# Altium schematic sheet Op_Amp_Sig_Process.SchDoc: Op-Amp Signal Pre-Processing
size B; SheetNumber: 4; SheetTotal: 5
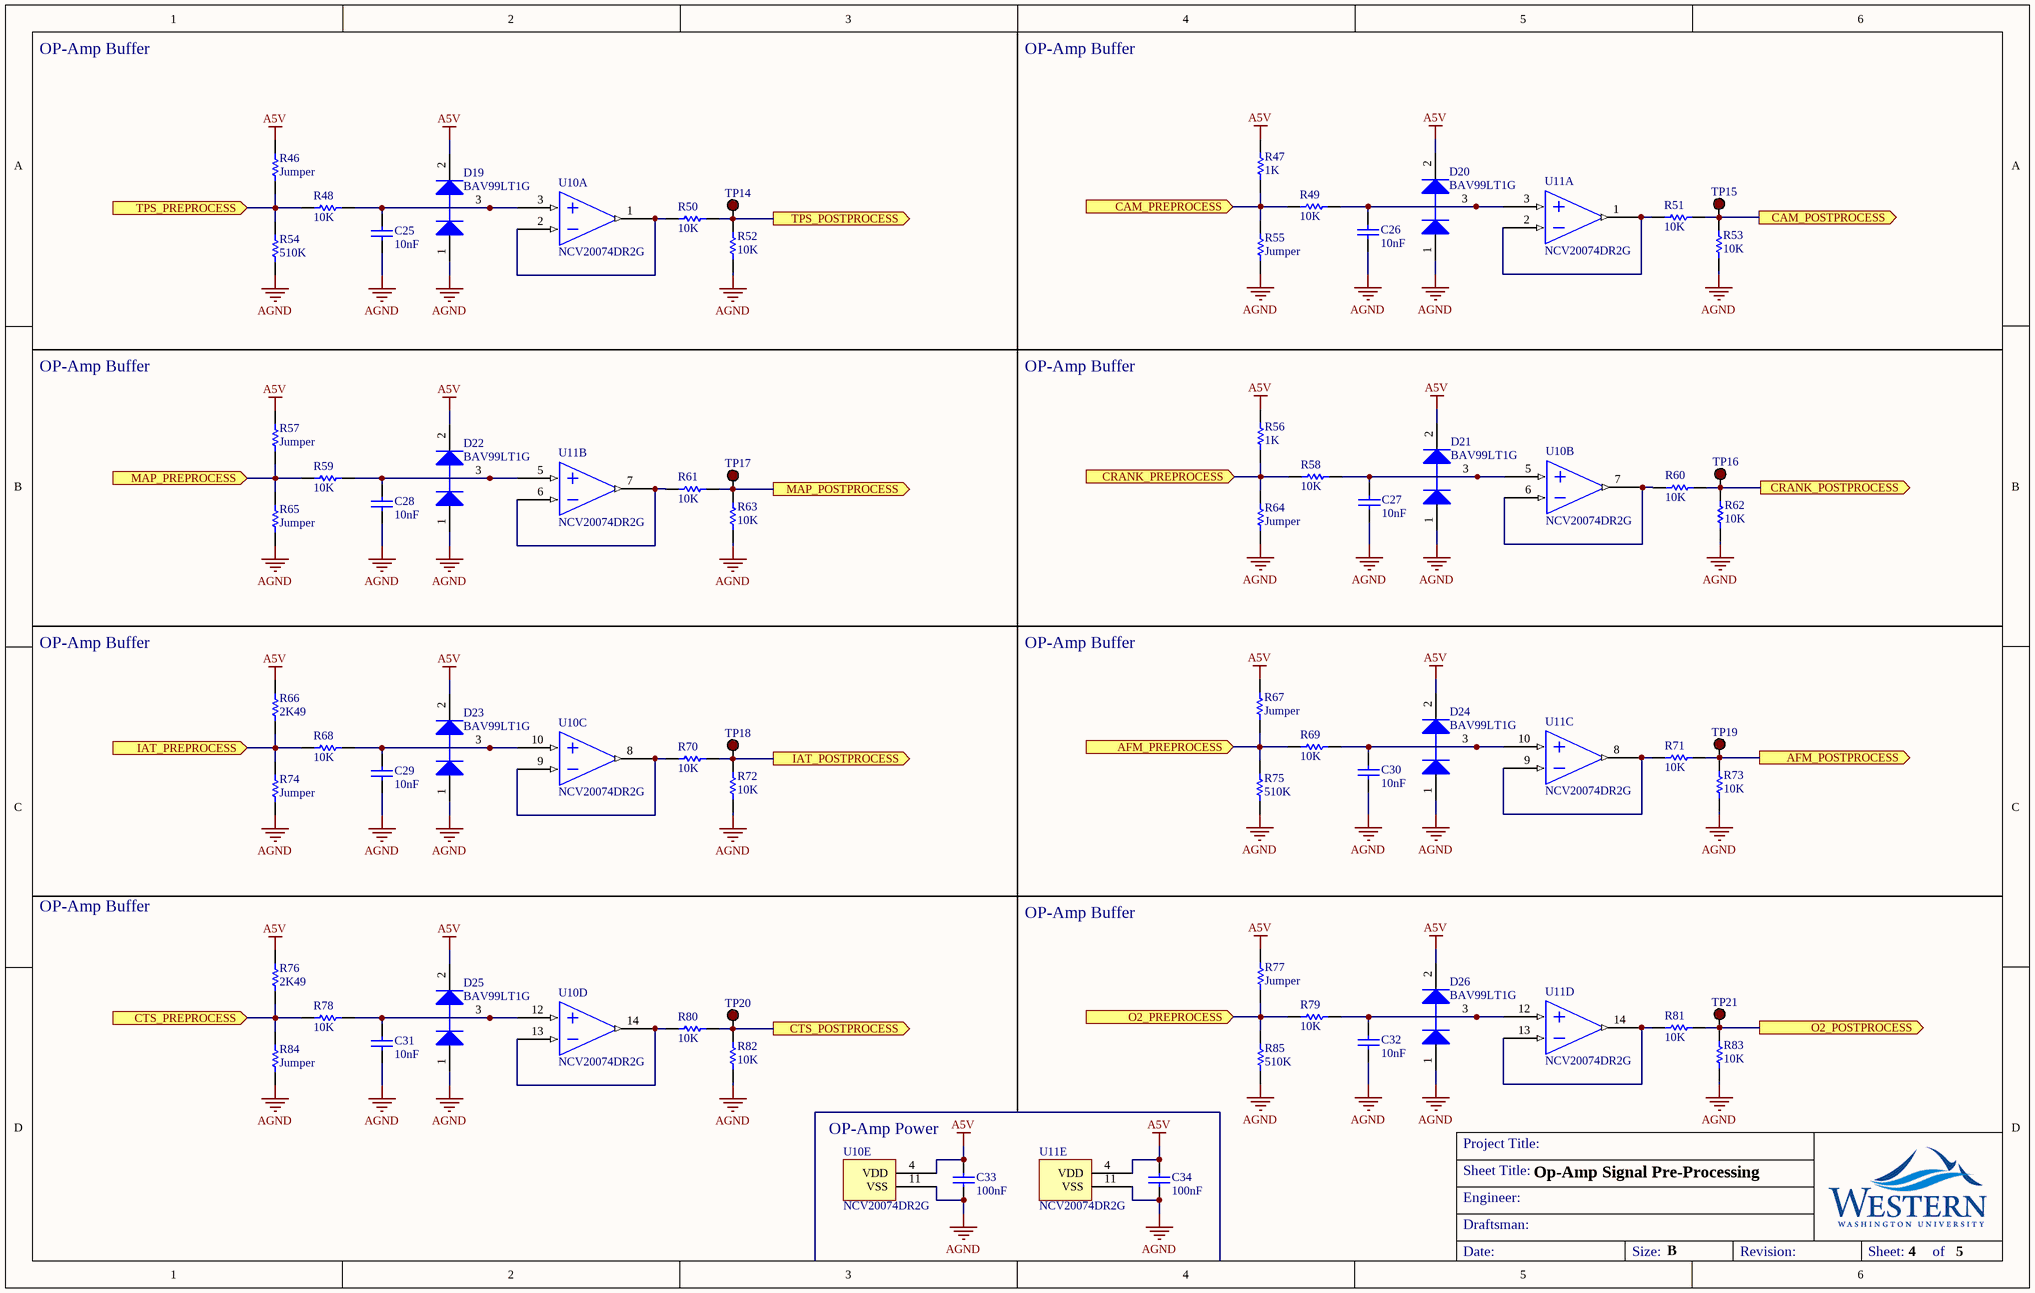
[diagram p0: Op_Amp_Sig_Process.SchDoc]

## Parts
C25  10nF  [CAPC0603(1608)100_M]
C26  10nF  [CAPC0603(1608)100_M]
C27  10nF  [CAPC0603(1608)100_M]
C28  10nF  [CAPC0603(1608)100_M]
C29  10nF  [CAPC0603(1608)100_M]
C30  10nF  [CAPC0603(1608)100_M]
C31  10nF  [CAPC0603(1608)100_M]
C32  10nF  [CAPC0603(1608)100_M]
C33  100nF  [CAPC0603(1608)100_M]
C34  100nF  [CAPC0603(1608)100_M]
D19  BAV99LT1G  [ONSC-SOT-23-3-318-08_V]
D20  BAV99LT1G  [ONSC-SOT-23-3-318-08_V]
D21  BAV99LT1G  [ONSC-SOT-23-3-318-08_V]
D22  BAV99LT1G  [ONSC-SOT-23-3-318-08_V]
D23  BAV99LT1G  [ONSC-SOT-23-3-318-08_V]
D24  BAV99LT1G  [ONSC-SOT-23-3-318-08_V]
D25  BAV99LT1G  [ONSC-SOT-23-3-318-08_V]
D26  BAV99LT1G  [ONSC-SOT-23-3-318-08_V]
R46  Jumper  [RESC0603(1608)_M]
R47  1K  [RESC0603(1608)_M]
R48  10K  [RESC0603(1608)_M]
R49  10K  [RESC0603(1608)_M]
R50  10K  [RESC0603(1608)_M]
R51  10K  [RESC0603(1608)_M]
R52  10K  [RESC0603(1608)_M]
R53  10K  [RESC0603(1608)_M]
R54  510K  [RESC0603(1608)_M]
R55  Jumper  [RESC0603(1608)_M]
R56  1K  [RESC0603(1608)_M]
R57  Jumper  [RESC0603(1608)_M]
R58  10K  [RESC0603(1608)_M]
R59  10K  [RESC0603(1608)_M]
R60  10K  [RESC0603(1608)_M]
R61  10K  [RESC0603(1608)_M]
R62  10K  [RESC0603(1608)_M]
R63  10K  [RESC0603(1608)_M]
R64  Jumper  [RESC0603(1608)_M]
R65  Jumper  [RESC0603(1608)_M]
R66  2K49  [RESC0603(1608)_M]
R67  Jumper  [RESC0603(1608)_M]
R68  10K  [RESC0603(1608)_M]
R69  10K  [RESC0603(1608)_M]
R70  10K  [RESC0603(1608)_M]
R71  10K  [RESC0603(1608)_M]
R72  10K  [RESC0603(1608)_M]
R73  10K  [RESC0603(1608)_M]
R74  Jumper  [RESC0603(1608)_M]
R75  510K  [RESC0603(1608)_M]
R76  2K49  [RESC0603(1608)_M]
R77  Jumper  [RESC0603(1608)_M]
R78  10K  [RESC0603(1608)_M]
R79  10K  [RESC0603(1608)_M]
R80  10K  [RESC0603(1608)_M]
R81  10K  [RESC0603(1608)_M]
R82  10K  [RESC0603(1608)_M]
R83  10K  [RESC0603(1608)_M]
R84  Jumper  [RESC0603(1608)_M]
R85  510K  [RESC0603(1608)_M]
TP14  5001  [Keystone_5001]  (value not drawn)
TP15  5001  [Keystone_5001]  (value not drawn)
TP16  5001  [Keystone_5001]  (value not drawn)
TP17  5001  [Keystone_5001]  (value not drawn)
TP18  5001  [Keystone_5001]  (value not drawn)
TP19  5001  [Keystone_5001]  (value not drawn)
TP20  5001  [Keystone_5001]  (value not drawn)
TP21  5001  [Keystone_5001]  (value not drawn)
U10  NCV20074DR2G  [NCV20074DR2G]  (parts A,B,C,D,E of 5)
U11  NCV20074DR2G  [NCV20074DR2G]  (parts A,B,C,D,E of 5)

## Ports
AFM_POSTPROCESS (out), AFM_PREPROCESS (in), CAM_POSTPROCESS (out), CAM_PREPROCESS (in), CRANK_POSTPROCESS (out), CRANK_PREPROCESS (in), CTS_POSTPROCESS (out), CTS_PREPROCESS (in), IAT_POSTPROCESS (out), IAT_PREPROCESS (in), MAP_POSTPROCESS (out), MAP_PREPROCESS (in), O2_POSTPROCESS (out), O2_PREPROCESS (in), TPS_POSTPROCESS (out), TPS_PREPROCESS (in)

## Nets
A5V: C33.2 C34.2 D19.2(K) D20.2(K) D21.2(K) D22.2(K) D23.2(K) D24.2(K) D25.2(K) D26.2(K) R46.2 R47.2 R56.2 R57.2 R66.2 R67.2 R76.2 R77.2 U10.4(VDD) U11.4(VDD)
AGND: C25.1 C26.1 C27.1 C28.1 C29.1 C30.1 C31.1 C32.1 C33.1 C34.1 D19.1(A) D20.1(A) D21.1(A) D22.1(A) D23.1(A) D24.1(A) D25.1(A) D26.1(A) R52.1 R53.1 R54.1 R55.1 R62.1 R63.1 R64.1 R65.1 R72.1 R73.1 R74.1 R75.1 R82.1 R83.1 R84.1 R85.1 U10.11(VSS) U11.11(VSS)
AFM_POSTPROCESS: R71.2 R73.2 TP19.1(TP) ; port AFM_POSTPROCESS
AFM_PREPROCESS: R67.1 R69.1 R75.2 ; port AFM_PREPROCESS
CAM_POSTPROCESS: R51.2 R53.2 TP15.1(TP) ; port CAM_POSTPROCESS
CAM_PREPROCESS: R47.1 R49.1 R55.2 ; port CAM_PREPROCESS
CRANK_POSTPROCESS: R60.2 R62.2 TP16.1(TP) ; port CRANK_POSTPROCESS
CRANK_PREPROCESS: R56.1 R58.1 R64.2 ; port CRANK_PREPROCESS
CTS_POSTPROCESS: R80.2 R82.2 TP20.1(TP) ; port CTS_POSTPROCESS
CTS_PREPROCESS: R76.1 R78.1 R84.2 ; port CTS_PREPROCESS
IAT_POSTPROCESS: R70.2 R72.2 TP18.1(TP) ; port IAT_POSTPROCESS
IAT_PREPROCESS: R66.1 R68.1 R74.2 ; port IAT_PREPROCESS
MAP_POSTPROCESS: R61.2 R63.2 TP17.1(TP) ; port MAP_POSTPROCESS
MAP_PREPROCESS: R57.1 R59.1 R65.2 ; port MAP_PREPROCESS
O2_POSTPROCESS: R81.2 R83.2 TP21.1(TP) ; port O2_POSTPROCESS
O2_PREPROCESS: R77.1 R79.1 R85.2 ; port O2_PREPROCESS
TPS_POSTPROCESS: R50.2 R52.2 TP14.1(TP) ; port TPS_POSTPROCESS
TPS_PREPROCESS: R46.1 R48.1 R54.2 ; port TPS_PREPROCESS
NetC25_2: C25.2 D19.3(K/A) R48.2 U10.3(IN1+)
NetC26_2: C26.2 D20.3(K/A) R49.2 U11.3(IN1+)
NetC27_2: C27.2 D21.3(K/A) R58.2 U10.5(IN2+)
NetC28_2: C28.2 D22.3(K/A) R59.2 U11.5(IN2+)
NetC29_2: C29.2 D23.3(K/A) R68.2 U10.10(IN3+)
NetC30_2: C30.2 D24.3(K/A) R69.2 U11.10(IN3+)
NetC31_2: C31.2 D25.3(K/A) R78.2 U10.12(IN4+)
NetC32_2: C32.2 D26.3(K/A) R79.2 U11.12(IN4+)
NetR50_1: R50.1 U10.1(OUT1) U10.2(IN1-)
NetR51_1: R51.1 U11.1(OUT1) U11.2(IN1-)
NetR60_1: R60.1 U10.6(IN2-) U10.7(OUT2)
NetR61_1: R61.1 U11.6(IN2-) U11.7(OUT2)
NetR70_1: R70.1 U10.8(OUT3) U10.9(IN3-)
NetR71_1: R71.1 U11.8(OUT3) U11.9(IN3-)
NetR80_1: R80.1 U10.13(IN4-) U10.14(OUT4)
NetR81_1: R81.1 U11.13(IN4-) U11.14(OUT4)

## Notes on the sheet
- OP-Amp Buffer
- OP-Amp Power
- Sheet Title:
- Project Title:
- Engineer:
- Draftsman:
- Date:
- Size:
- B
- Revision:
- Sheet:        of

## Library data of the parts
C25-C32 = CMP-1035-02320-1: CAP 10nF 50V ±5% 0603 (1608 Metric) Thickness 1mm SMD; Case-EIA: 0603; Tolerance: Â±5%; Case-Metric: 1608; Value: 10nF; Max Thickness: 1 mm; Technology: SMT; Rated Voltage: 50 V
C33 C34 = CMP-1035-02580-1: CAP 100nF 10V ±10% 0603 (1608 Metric) Thickness 1mm SMD; Tolerance: Â±10%; Case-EIA: 0603; Case-Metric: 1608; Max Thickness: 1 mm; Value: 100nF; Rated Voltage: 10 V; Technology: SMT
D19-D26 = CMP-1054-00085-1: Dual Series Switching Diodes, 3-Pin SOT-23, Pb-Free, Tape and Reel; Manufacturer: On Semiconductor; trr Max (ns): 6; IF Max (A): 0.215; Configuration: Dual Series; PackageDescription: 3-Pin Small Outline Transistor, Body 2.92 x 1.3 mm, Pitch 0.95 mm; PackageVersion: Rev. AP, 11/2009; ComponentLink1Description: Manufacturer URL; RoHS: TRUE; PartNumber: BAV99LT1G; ComponentLink3URL: http://www.onsemi.cn/pub_link/Collateral/318-08.PDF; DatasheetVersion: Rev. 9; PackageReference: SOT-23-3-318-08; ComponentLink2Description: Datasheet; Packing: Tape and Reel; Mounting Technology: Surface Mount; ComponentLink1URL: http://www.onsemi.com/; ComponentLink3Description: Package Specification; ComponentLink2URL: http://www.onsemi.cn/pub_link/Collateral/BAV99LT1-D.PDF
R46 R55 R57 R64 R65 R67 R74 R77 R84 = CMP-1012-00001-1: Jumper 0603 (1608 Metric); Case-Metric: 1608; Value: 0.00 Ohm; Power: None; Case-EIA: 0603; Technology: SMT; Tolerance: None
R47 R56 = CMP-1012-00510-1: 1K 0.1W 1% 0603 (1608 Metric)  SMD; Case-Metric: 1608; Case-EIA: 0603; Value: 1000.00 Ohm; Technology: SMT; Tolerance: 1 %; Power: 0.1 W
R48-R53 R58-R63 R68-R73 R78-R83 = CMP-1012-00623-1: 10K 0.1W 1% 0603 (1608 Metric)  SMD; Value: 10000.00 Ohm; Case-EIA: 0603; Case-Metric: 1608; Power: 0.1 W; Tolerance: 1 %; Technology: SMT
R54 R75 R85 = CMP-1012-00816-1: 510K 0.1W 1% 0603 (1608 Metric)  SMD; Value: 510000.00 Ohm; Case-EIA: 0603; Case-Metric: 1608; Tolerance: 1 %; Technology: SMT; Power: 0.1 W
R66 R76 = CMP-1012-00553-1: 2K49 0.1W 1% 0603 (1608 Metric)  SMD; Case-EIA: 0603; Value: 2490.00 Ohm; Case-Metric: 1608; Tolerance: 1 %; Technology: SMT; Power: 0.1 W
TP14-TP21 = TEST POINT: TEST POINT PC MINI .040"D BLACK; Manufacturer: Keystone Electronics; Supplier 1: Digi-Key; Manufacturer Part Number: 5001; RoHS: RoHS Compliant; Category: Test and Measurement; Stock 1: 7538; Pricing 1: 1=0.34, 10=0.315, 50=0.2296, 100=0.2206, 250=0.19812, 500=0.1891, 1000=0.15759, 2500=0.14408, 5000=0.13508 (USD); Packaging: Bulk; Type: PC Test Point, Miniature; Terminal: 0.010" x 0.020" (0.25mm x 0.51mm) Phosphor Bronze Wire, Silver Plated; Mounting Type: 0.040" (1.02mm) Hole Diameter; Material: Base, Nylon 46, UL 94V-0; Color: Black; ComponentLink1URL: http://www.keyelco.com/product-pdf.cfm?p=1310; ComponentLink1Description: http://www.keyelco.com/product-pdf.cfm?p=1310; Supplier Part Number 1: 5001K-ND